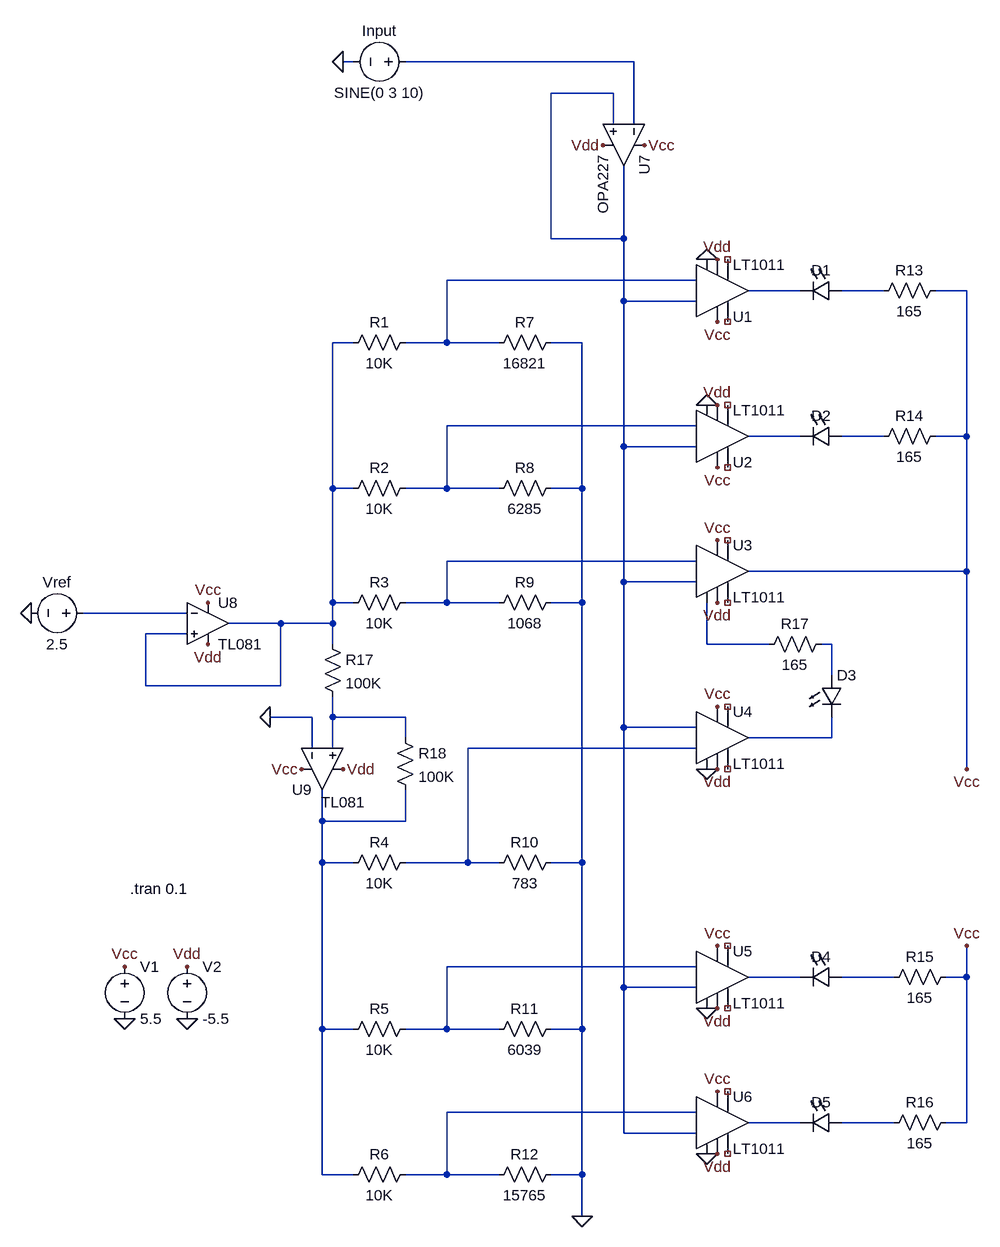
[diagram p0: schematic Komparator 27.11.15.asc]
Komparator 27.11.15.asc, the LTspice schematic file:
Version 4
SHEET 1 996 1952
WIRE -32 -288 -48 -288
WIRE 400 -288 48 -288
WIRE 368 -240 272 -240
WIRE 368 -192 368 -240
WIRE 400 -192 400 -288
WIRE 272 -16 272 -240
WIRE 384 -16 384 -128
WIRE 384 -16 272 -16
WIRE 496 48 112 48
WIRE 656 64 576 64
WIRE 784 64 720 64
WIRE 912 64 864 64
WIRE 384 80 384 -16
WIRE 496 80 384 80
WIRE -32 144 -64 144
WIRE 112 144 112 48
WIRE 112 144 48 144
WIRE 192 144 112 144
WIRE 320 144 272 144
WIRE 496 272 112 272
WIRE 656 288 576 288
WIRE 784 288 720 288
WIRE 912 288 912 64
WIRE 912 288 864 288
WIRE 384 304 384 80
WIRE 496 304 384 304
WIRE -64 368 -64 144
WIRE -32 368 -64 368
WIRE 112 368 112 272
WIRE 112 368 48 368
WIRE 192 368 112 368
WIRE 320 368 320 144
WIRE 320 368 272 368
WIRE 496 480 112 480
WIRE 912 496 912 288
WIRE 912 496 576 496
WIRE 384 512 384 304
WIRE 496 512 384 512
WIRE -64 544 -64 368
WIRE -32 544 -64 544
WIRE 112 544 112 480
WIRE 112 544 48 544
WIRE 192 544 112 544
WIRE 320 544 320 368
WIRE 320 544 272 544
WIRE -288 560 -448 560
WIRE -144 576 -224 576
WIRE -64 576 -64 544
WIRE -64 576 -144 576
WIRE -288 592 -352 592
WIRE -64 608 -64 576
WIRE 512 608 512 544
WIRE 608 608 512 608
WIRE 704 608 688 608
WIRE 704 656 704 608
WIRE -352 672 -352 592
WIRE -144 672 -144 576
WIRE -144 672 -352 672
WIRE -96 720 -160 720
WIRE -64 720 -64 688
WIRE 48 720 -64 720
WIRE 384 736 384 512
WIRE 496 736 384 736
WIRE 48 752 48 720
WIRE 704 752 704 720
WIRE 704 752 576 752
WIRE -96 768 -96 720
WIRE -64 768 -64 720
WIRE 496 768 144 768
WIRE 912 800 912 496
WIRE -80 880 -80 832
WIRE 48 880 48 832
WIRE 48 880 -80 880
WIRE -80 944 -80 880
WIRE -32 944 -80 944
WIRE 144 944 144 768
WIRE 144 944 48 944
WIRE 192 944 144 944
WIRE 320 944 320 544
WIRE 320 944 272 944
WIRE 496 1104 112 1104
WIRE 656 1120 576 1120
WIRE 800 1120 720 1120
WIRE 912 1120 912 1072
WIRE 912 1120 880 1120
WIRE 384 1136 384 736
WIRE 496 1136 384 1136
WIRE -80 1200 -80 944
WIRE -32 1200 -80 1200
WIRE 112 1200 112 1104
WIRE 112 1200 48 1200
WIRE 192 1200 112 1200
WIRE 320 1200 320 944
WIRE 320 1200 272 1200
WIRE 496 1328 112 1328
WIRE 656 1344 576 1344
WIRE 800 1344 720 1344
WIRE 912 1344 912 1120
WIRE 912 1344 880 1344
WIRE 384 1360 384 1136
WIRE 496 1360 384 1360
WIRE -80 1424 -80 1200
WIRE -32 1424 -80 1424
WIRE 112 1424 112 1328
WIRE 112 1424 48 1424
WIRE 192 1424 112 1424
WIRE 320 1424 320 1200
WIRE 320 1424 272 1424
WIRE 320 1488 320 1424
FLAG -48 -288 0
FLAG 512 800 0
FLAG 912 800 Vcc
FLAG 912 1072 Vcc
FLAG 528 448 Vcc
FLAG 528 704 Vcc
FLAG 528 800 Vdd
FLAG 320 1488 0
FLAG -384 1104 Vcc
FLAG -528 560 0
FLAG -160 720 0
FLAG -384 1184 0
FLAG -288 1184 0
FLAG -288 1104 Vdd
FLAG 528 544 Vdd
FLAG 416 -160 Vcc
FLAG -112 800 Vcc
FLAG -48 800 Vdd
FLAG 352 -160 Vdd
FLAG 512 16 0
FLAG 512 240 0
FLAG 528 336 Vcc
FLAG 528 112 Vcc
FLAG 528 16 Vdd
FLAG 528 240 Vdd
FLAG 528 1296 Vcc
FLAG 528 1072 Vcc
FLAG 528 1168 Vdd
FLAG 528 1392 Vdd
FLAG 512 1168 0
FLAG 512 1392 0
FLAG -256 544 Vcc
FLAG -256 608 Vdd
SYMBOL LED 720 48 R90
WINDOW 0 0 32 VBottom 2
WINDOW 3 32 32 VTop 2
SYMATTR InstName D1
SYMATTR Value ""
SYMATTR Description Diode
SYMATTR Type diode
SYMBOL res 288 128 R90
WINDOW 0 0 56 VBottom 2
WINDOW 3 32 56 VTop 2
SYMATTR InstName R7
SYMATTR Value 16821
SYMBOL res 64 128 R90
WINDOW 0 0 56 VBottom 2
WINDOW 3 32 56 VTop 2
SYMATTR InstName R1
SYMATTR Value 10K
SYMBOL voltage 64 -288 R90
WINDOW 0 -32 56 VBottom 2
WINDOW 3 32 56 VTop 2
SYMATTR InstName Input
SYMATTR Value SINE(0 3 10)
SYMBOL res 880 48 R90
WINDOW 0 0 56 VBottom 2
WINDOW 3 32 56 VTop 2
SYMATTR InstName R13
SYMATTR Value 165
SYMBOL res 288 352 R90
WINDOW 0 0 56 VBottom 2
WINDOW 3 32 56 VTop 2
SYMATTR InstName R8
SYMATTR Value 6285
SYMBOL res 64 352 R90
WINDOW 0 0 56 VBottom 2
WINDOW 3 32 56 VTop 2
SYMATTR InstName R2
SYMATTR Value 10K
SYMBOL res 880 272 R90
WINDOW 0 0 56 VBottom 2
WINDOW 3 32 56 VTop 2
SYMATTR InstName R14
SYMATTR Value 165
SYMBOL Comparators/LT1011 528 496 R0
SYMATTR InstName U3
SYMBOL Comparators/LT1011 528 752 R0
SYMATTR InstName U4
SYMBOL res 64 528 R90
WINDOW 0 0 56 VBottom 2
WINDOW 3 32 56 VTop 2
SYMATTR InstName R3
SYMATTR Value 10K
SYMBOL res 288 528 R90
WINDOW 0 0 56 VBottom 2
WINDOW 3 32 56 VTop 2
SYMATTR InstName R9
SYMATTR Value 1068
SYMBOL res -80 592 R0
SYMATTR InstName R17
SYMATTR Value 100K
SYMBOL res 32 736 R0
SYMATTR InstName R18
SYMATTR Value 100K
SYMBOL res 64 1184 R90
WINDOW 0 0 56 VBottom 2
WINDOW 3 32 56 VTop 2
SYMATTR InstName R5
SYMATTR Value 10K
SYMBOL res 288 1184 R90
WINDOW 0 0 56 VBottom 2
WINDOW 3 32 56 VTop 2
SYMATTR InstName R11
SYMATTR Value 6039
SYMBOL res 64 1408 R90
WINDOW 0 0 56 VBottom 2
WINDOW 3 32 56 VTop 2
SYMATTR InstName R6
SYMATTR Value 10K
SYMBOL res 288 1408 R90
WINDOW 0 0 56 VBottom 2
WINDOW 3 32 56 VTop 2
SYMATTR InstName R12
SYMATTR Value 15765
SYMBOL LED 720 1104 R90
WINDOW 0 0 32 VBottom 2
WINDOW 3 48 48 Bottom 2
SYMATTR InstName D4
SYMATTR Value ""
SYMATTR Description Diode
SYMATTR Type diode
SYMBOL LED 720 1328 R90
WINDOW 0 0 32 VBottom 2
WINDOW 3 32 32 VTop 2
SYMATTR InstName D5
SYMATTR Value ""
SYMATTR Description Diode
SYMATTR Type diode
SYMBOL res 896 1104 R90
WINDOW 0 0 56 VBottom 2
WINDOW 3 32 56 VTop 2
SYMATTR InstName R15
SYMATTR Value 165
SYMBOL res 896 1328 R90
WINDOW 0 0 56 VBottom 2
WINDOW 3 32 56 VTop 2
SYMATTR InstName R16
SYMATTR Value 165
SYMBOL voltage -432 560 R90
WINDOW 0 -32 56 VBottom 2
WINDOW 3 32 56 VTop 2
SYMATTR InstName Vref
SYMATTR Value 2.5
SYMBOL voltage -288 1088 R0
SYMATTR InstName V2
SYMATTR Value -5.5
SYMBOL voltage -384 1088 R0
SYMATTR InstName V1
SYMATTR Value 5.5
SYMBOL res 704 592 R90
WINDOW 0 0 56 VBottom 2
WINDOW 3 32 56 VTop 2
SYMATTR InstName R17
SYMATTR Value 165
SYMBOL Opamps\\TL081 -144 800 M90
WINDOW 0 32 48 VLeft 2
WINDOW 3 51 131 VLeft 2
SYMATTR InstName U9
SYMBOL Opamps\\OPA227 448 -160 R90
SYMATTR InstName U7
SYMBOL LED 688 656 R0
WINDOW 3 113 154 VLeft 2
SYMATTR Value ""
SYMATTR InstName D3
SYMATTR Description Diode
SYMATTR Type diode
SYMBOL Comparators\\LT1011 528 64 M180
SYMATTR InstName U1
SYMBOL Comparators\\LT1011 528 288 M180
SYMATTR InstName U2
SYMBOL Comparators\\LT1011 528 1120 R0
SYMATTR InstName U5
SYMBOL Comparators\\LT1011 528 1344 R0
SYMATTR InstName U6
SYMBOL res 64 928 R90
WINDOW 0 0 56 VBottom 2
WINDOW 3 32 56 VTop 2
SYMATTR InstName R4
SYMATTR Value 10K
SYMBOL res 288 928 R90
WINDOW 0 0 56 VBottom 2
WINDOW 3 32 56 VTop 2
SYMATTR InstName R10
SYMATTR Value 783
SYMBOL LED 720 272 R90
WINDOW 0 0 32 VBottom 2
WINDOW 3 32 32 VTop 2
SYMATTR InstName D2
SYMATTR Value ""
SYMATTR Description Diode
SYMATTR Type diode
SYMBOL Opamps\\TL081 -256 512 R0
SYMATTR InstName U8
TEXT -376 984 Left 2 !.tran 0.1

The netlist it stands for:
* Komparator 27.11.15.asc
D1 N005 N004
R7 0 N003 16821
R1 N003 N006 10K
V§Input N001 0 SINE(0 3 10)
R13 Vcc N005 165
R8 0 N007 6285
R2 N007 N006 10K
R14 Vcc N009 165
XU3 N012 N002 N010 Vdd NC_01 NC_02 Vcc Vcc LT1011
XU4 0 N016 N002 Vdd NC_03 NC_04 N015 Vcc LT1011
R3 N010 N006 10K
R9 0 N010 1068
R17 N006 N014 100K
R18 N014 N017 100K
R5 N018 N017 10K
R11 0 N018 6039
R6 N021 N017 10K
R12 0 N021 15765
D4 N020 N019
D5 N023 N022
R15 Vcc N020 165
R16 Vcc N023 165
Vref N011 0 2.5
V2 Vdd 0 -5.5
V1 Vcc 0 5.5
R17 N013 N012 165
XU9 N014 0 Vcc Vdd N017 TL081  ; pins In+ In- V+ V- OUT
XU7 N002 N001 Vcc Vdd N002 OPA227  ; pins In+ In- V+ V- OUT
D3 N013 N015
XU1 0 N003 N002 Vdd NC_05 NC_06 N004 Vcc LT1011
XU2 0 N007 N002 Vdd NC_07 NC_08 N008 Vcc LT1011
XU5 0 N002 N018 Vdd NC_09 NC_10 N019 Vcc LT1011
XU6 0 N002 N021 Vdd NC_11 NC_12 N022 Vcc LT1011
R4 N016 N017 10K
R10 0 N016 783
D2 N009 N008
XU8 N006 N011 Vcc Vdd N006 TL081  ; pins In+ In- V+ V- OUT
.model D D
.lib standard.dio
.tran 0.1
.lib LTC1.lib
.backanno
.end